# Altium project zhuzhuan1.PrjPcb
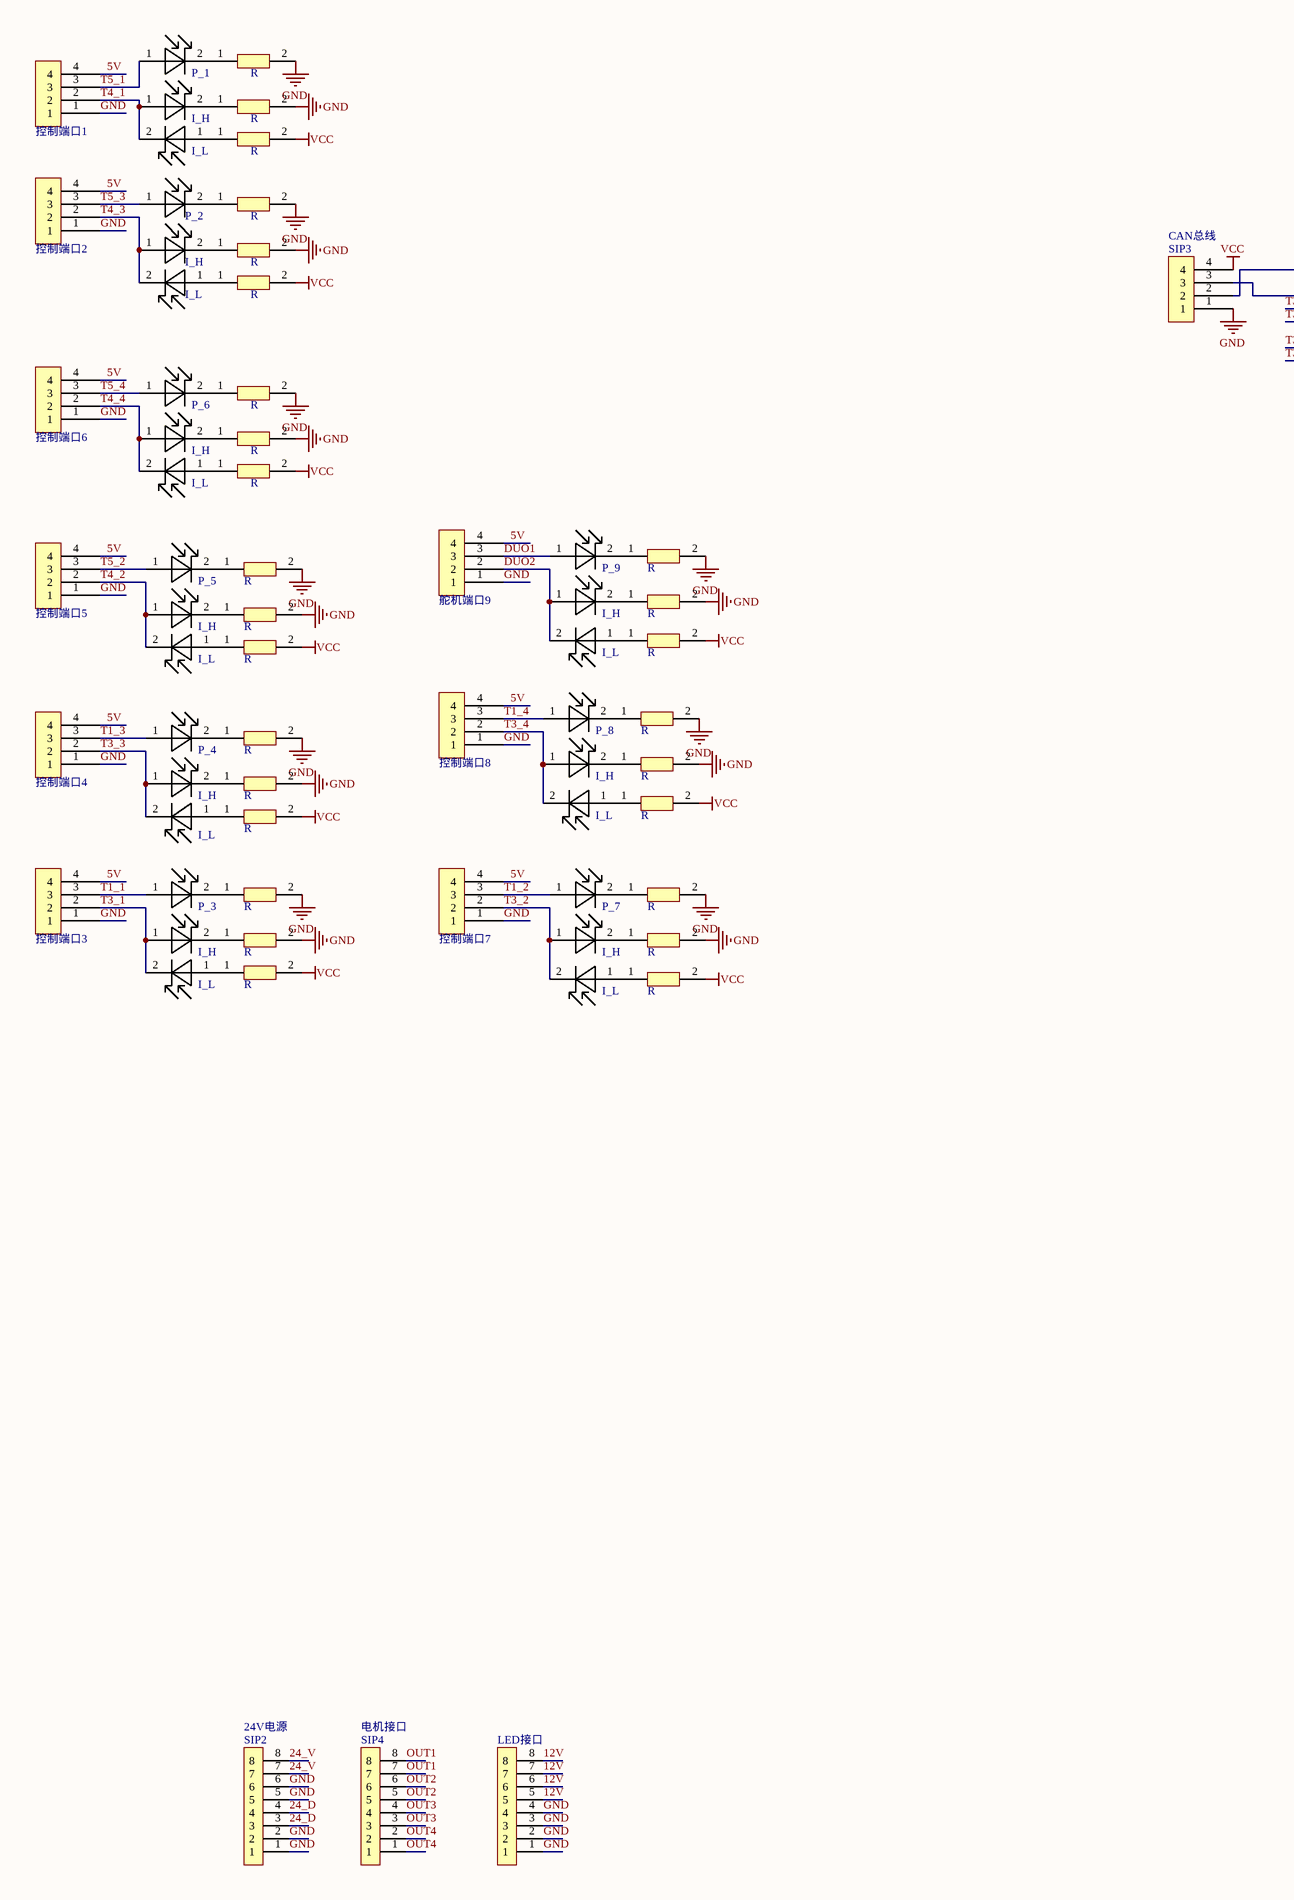
[diagram p0: zhuzhuan1.SchDoc, left]
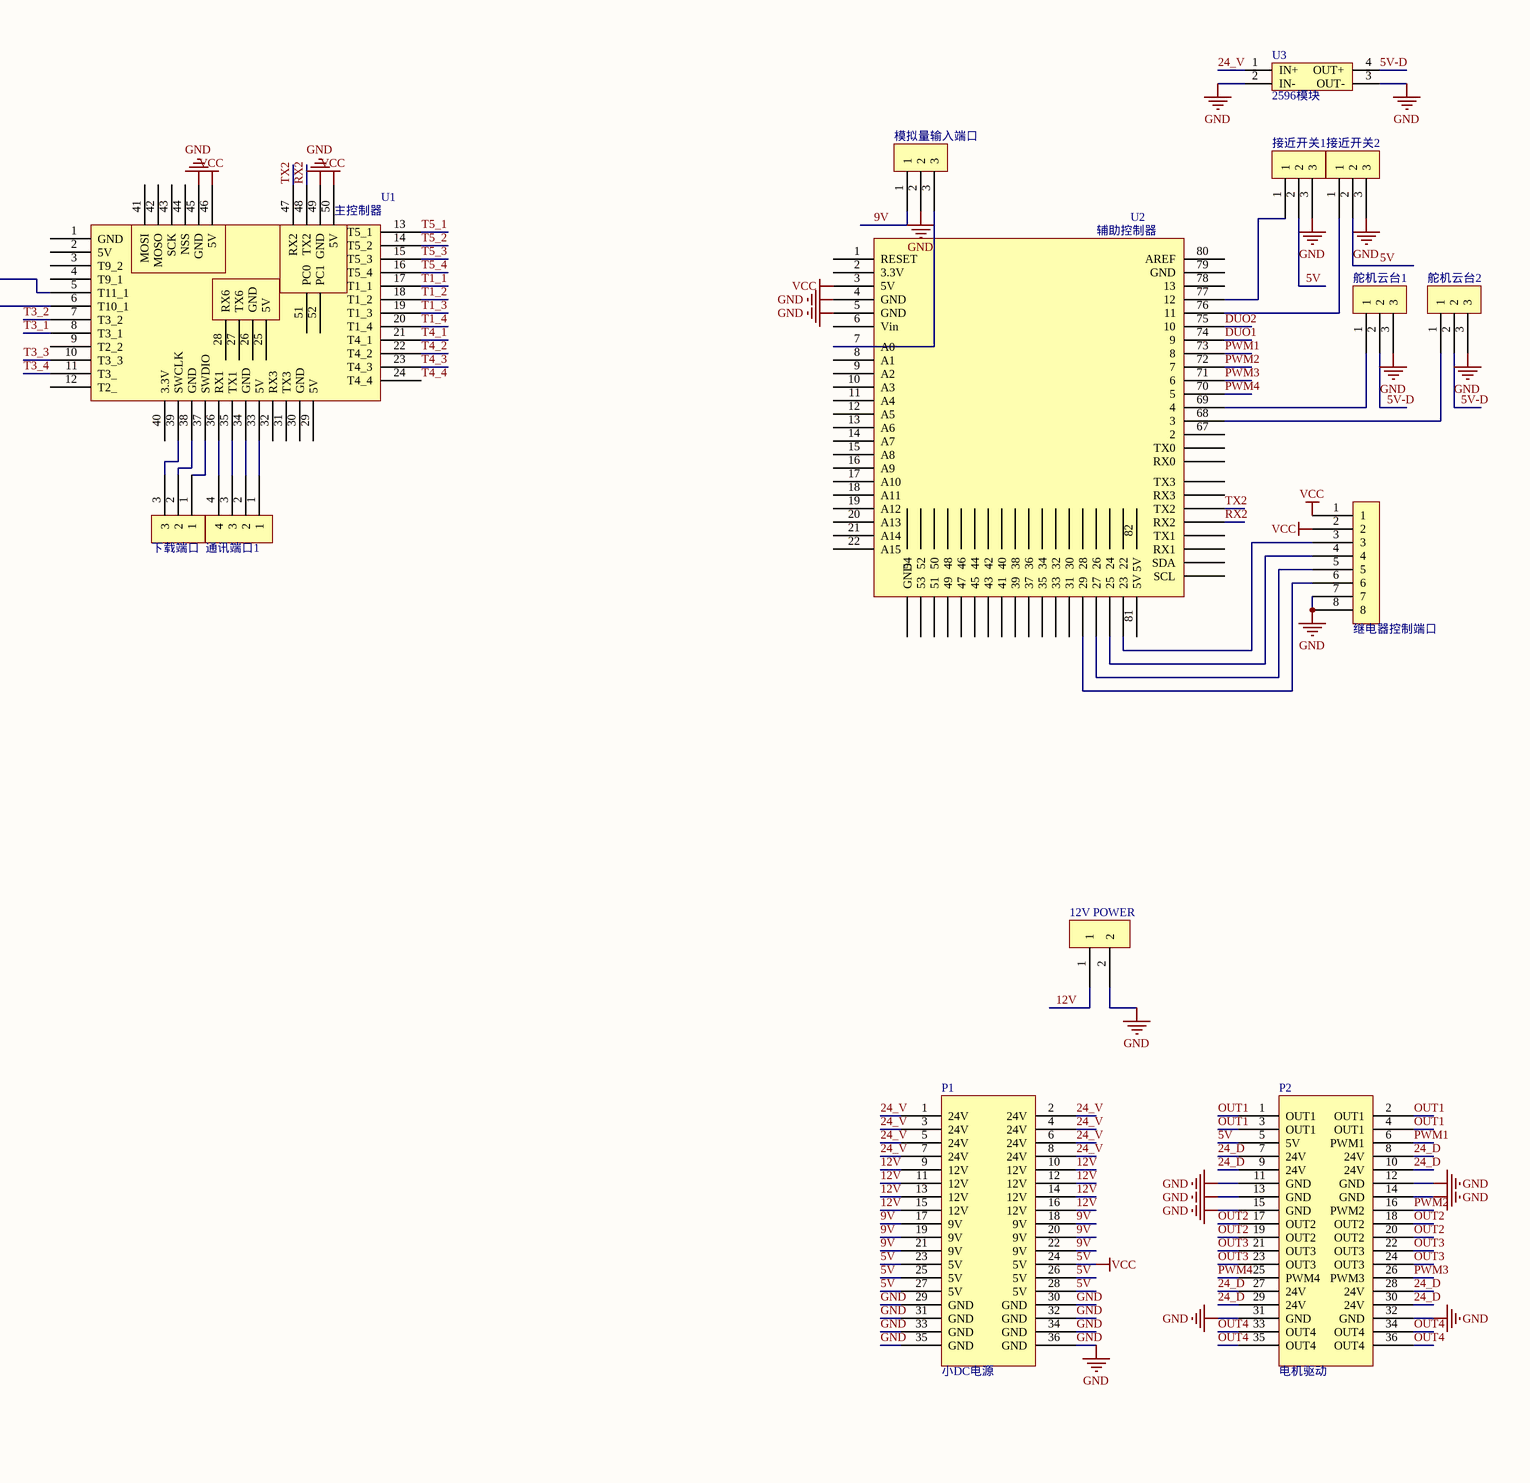
[diagram p1: zhuzhuan1.SchDoc, right]
1 sheet, 81 parts. Net scope: global (net labels, ports and power ports of the same name join across sheets).
Board file: zhuzhuan1.PcbDoc

## Sheet zhuzhuan1.SchDoc
size A2

### Parts
12V_POWER  SIP2  [SIP2-3MM]  (value not drawn)
L1  P_1  [LED-T]
L2  I_H  [LED-T]
L3  I_L  [LED-T]
L4  P_2  [LED-T]
L5  I_H  [LED-T]
L6  I_L  [LED-T]
L7  P_3  [LED-T]
L8  I_H  [LED-T]
L9  I_L  [LED-T]
L10  P_4  [LED-T]
L11  I_H  [LED-T]
L12  I_L  [LED-T]
L13  P_5  [LED-T]
L14  I_H  [LED-T]
L15  I_L  [LED-T]
L16  P_6  [LED-T]
L17  I_H  [LED-T]
L18  I_L  [LED-T]
L19  P_7  [LED-T]
L20  I_H  [LED-T]
L21  I_L  [LED-T]
L22  P_8  [LED-T]
L23  I_H  [LED-T]
L24  I_L  [LED-T]
L25  P_9  [LED-T]
L26  I_H  [LED-T]
L27  I_L  [LED-T]
P1  小DC电源  [DIP36-3.96MM]
P2  电机驱动  [DIP36-3.96MM]
R1  R  [RES-T]
R2  R  [RES-T]
R3  R  [RES-T]
R4  R  [RES-T]
R5  R  [RES-T]
R6  R  [RES-T]
R7  R  [RES-T]
R8  R  [RES-T]
R9  R  [RES-T]
R10  R  [RES-T]
R11  R  [RES-T]
R12  R  [RES-T]
R13  R  [RES-T]
R14  R  [RES-T]
R15  R  [RES-T]
R16  R  [RES-T]
R17  R  [RES-T]
R18  R  [RES-T]
R19  R  [RES-T]
R20  R  [RES-T]
R21  R  [RES-T]
R22  R  [RES-T]
R23  R  [RES-T]
R24  R  [RES-T]
R25  R  [RES-T]
R26  R  [RES-T]
R27  R  [RES-T]
SIP2  24V电源  [SIP8*3MM]
SIP3  CAN总线  [SIP4]
SIP4  电机接口  [SIP8*3MM]
SIP5  下载端口  [SIP3]
SIP7  控制端口1  [SIP4]
SIP8  控制端口2  [SIP4]
SIP9  控制端口3  [SIP4]
SIP10  控制端口4  [SIP4]
SIP11  控制端口5  [SIP4]
SIP12  控制端口6  [SIP4]
SIP13  控制端口7  [SIP4]
SIP14  控制端口8  [SIP4]
SIP15  舵机云台1  [SIP3-3MM]
SIP16  舵机云台2  [SIP3-3MM]
SIP17  模拟量输入端口  [SIP3-3MM]
SIP18  舵机端口9  [SIP4]
SIP19  LED接口  [SIP8*3MM]
SIP20  接近开关1  [SIP3-3MM]
SIP21  接近开关2  [SIP3-3MM]
SIP22  继电器控制端口  [SIP8]
U1  主控制器  [-----STM32F407-----]
U2  辅助控制器  [ARDUINO 2560]
U3  2596模块  [2596模块]
通讯端口1  SIP4  [SIP4]  (value not drawn)

### Nets
5V: P1.23(5V) P1.24(5V) P1.25(5V) P1.26(5V) P1.27(5V) P1.28(5V) P2.5(5V) R3.2 R6.2 R9.2 R12.2 R15.2 R18.2 R21.2 R24.2 R27.2 SIP3.4 SIP7.4 SIP8.4 SIP9.4 SIP10.4 SIP11.4 SIP12.4 SIP13.4 SIP14.4 SIP18.4 SIP20.2 SIP21.2 SIP22.1 SIP22.2 U1.46(5V) U1.50(5V) U2.3(5V)  [also labelled VCC]
GND: 12V_POWER.2 P1.29(GND) P1.30(GND) P1.31(GND) P1.32(GND) P1.33(GND) P1.34(GND) P1.35(GND) P1.36(GND) P2.11(GND) P2.12(GND) P2.13(GND) P2.14(GND) P2.15(GND) P2.31(GND) P2.32(GND) R1.2 R2.2 R4.2 R5.2 R7.2 R8.2 R10.2 R11.2 R13.2 R14.2 R16.2 R17.2 R19.2 R20.2 R22.2 R23.2 R25.2 R26.2 SIP2.1 SIP2.2 SIP2.5 SIP2.6 SIP3.1 SIP7.1 SIP8.1 SIP9.1 SIP10.1 SIP11.1 SIP12.1 SIP13.1 SIP14.1 SIP15.3 SIP16.3 SIP17.2 SIP18.1 SIP19.1 SIP19.2 SIP19.3 SIP19.4 SIP20.3 SIP21.3 SIP22.7 SIP22.8 U1.45(GND) U1.49(GND) U2.4(GND) U2.5(GND) U3.2(IN-) U3.3(OUT-)
5V-D: SIP15.2 SIP16.2 U3.4(OUT+)
9V: P1.17(9V) P1.18(9V) P1.19(9V) P1.20(9V) P1.21(9V) P1.22(9V) SIP17.1
12V: 12V_POWER.1 P1.9(12V) P1.10(12V) P1.11(12V) P1.12(12V) P1.13(12V) P1.14(12V) P1.15(12V) P1.16(12V) SIP19.5 SIP19.6 SIP19.7 SIP19.8
24_D: P2.7(24V) P2.8(24V) P2.9(24V) P2.10(24V) P2.27(24V) P2.28(24V) P2.29(24V) P2.30(24V) SIP2.3 SIP2.4
24_V: P1.1(24V) P1.2(24V) P1.3(24V) P1.4(24V) P1.5(24V) P1.6(24V) P1.7(24V) P1.8(24V) SIP2.7 SIP2.8 U3.1(IN+)
DUO1: L25.1 SIP18.3 U2.74(9)
DUO2: L26.1 L27.2 SIP18.2 U2.75(10)
OUT1: P2.1(OUT1) P2.2(OUT1) P2.3(OUT1) P2.4(OUT1) SIP4.7 SIP4.8
OUT2: P2.17(OUT2) P2.18(OUT2) P2.19(OUT2) P2.20(OUT2) SIP4.5 SIP4.6
OUT3: P2.21(OUT3) P2.22(OUT3) P2.23(OUT3) P2.24(OUT3) SIP4.3 SIP4.4
OUT4: P2.33(OUT4) P2.34(OUT4) P2.35(OUT4) P2.36(OUT4) SIP4.1 SIP4.2
PWM1: P2.6(PWM1) U2.73(8)
PWM2: P2.16(PWM2) U2.72(7)
PWM3: P2.26(PWM3) U2.71(6)
PWM4: P2.25(PWM4) U2.70(5)
RX2: U1.48(TX2) U2.61(RX2)
T1_1: L7.1 SIP9.3 U1.17(T1_1)
T1_2: L19.1 SIP13.3 U1.18(T1_2)
T1_3: L10.1 SIP10.3 U1.19(T1_3)
T1_4: L22.1 SIP14.3 U1.20(T1_4)
T3_1: L8.1 L9.2 SIP9.2 U1.8(T3_1)
T3_2: L20.1 L21.2 SIP13.2 U1.7(T3_2)
T3_3: L11.1 L12.2 SIP10.2 U1.10(T3_3)
T3_4: L23.1 L24.2 SIP14.2 U1.11(T3_)
T4_1: L2.1 L3.2 SIP7.2 U1.21(T4_1)
T4_2: L14.1 L15.2 SIP11.2 U1.22(T4_2)
T4_3: L5.1 L6.2 SIP8.2 U1.23(T4_3)
T4_4: L17.1 L18.2 SIP12.2 U1.24(T4_4)
T5_1: L1.1 SIP7.3 U1.13(T5_1)
T5_2: L13.1 SIP11.3 U1.14(T5_2)
T5_3: L4.1 SIP8.3 U1.15(T5_3)
T5_4: L16.1 SIP12.3 U1.16(T5_4)
TX2: U1.47(RX2) U2.62(TX2)
NetL1_2: L1.2 R1.1
NetL2_2: L2.2 R2.1
NetL3_1: L3.1 R3.1
NetL4_2: L4.2 R4.1
NetL5_2: L5.2 R5.1
NetL6_1: L6.1 R6.1
NetL7_2: L7.2 R7.1
NetL8_2: L8.2 R8.1
NetL9_1: L9.1 R9.1
NetL10_2: L10.2 R10.1
NetL11_2: L11.2 R11.1
NetL12_1: L12.1 R12.1
NetL13_2: L13.2 R13.1
NetL14_2: L14.2 R14.1
NetL15_1: L15.1 R15.1
NetL16_2: L16.2 R16.1
NetL17_2: L17.2 R17.1
NetL18_1: L18.1 R18.1
NetL19_2: L19.2 R19.1
NetL20_2: L20.2 R20.1
NetL21_1: L21.1 R21.1
NetL22_2: L22.2 R22.1
NetL23_2: L23.2 R23.1
NetL24_1: L24.1 R24.1
NetL25_2: L25.2 R25.1
NetL26_2: L26.2 R26.1
NetL27_1: L27.1 R27.1
NetSIP3_2: SIP3.2 U1.5(T11_1)
NetSIP3_3: SIP3.3 U1.6(T10_1)
NetSIP5_1: SIP5.1 U1.37(SWDIO)
NetSIP5_2: SIP5.2 U1.38(GND)
NetSIP5_3: SIP5.3 U1.39(SWCLK)
NetSIP15_1: SIP15.1 U2.69(4)
NetSIP16_1: SIP16.1 U2.68(3)
NetSIP17_3: SIP17.3 U2.7(A0)
NetSIP20_1: SIP20.1 U2.77(12)
NetSIP21_1: SIP21.1 U2.76(11)
NetSIP22_3: SIP22.3 U2.24(23)
NetSIP22_4: SIP22.4 U2.26(25)
NetSIP22_5: SIP22.5 U2.28(27)
NetSIP22_6: SIP22.6 U2.30(29)
NetU1_33: U1.33(5V) 通讯端口1.1
NetU1_34: U1.34(GND) 通讯端口1.2
NetU1_35: U1.35(TX1) 通讯端口1.3
NetU1_36: U1.36(RX1) 通讯端口1.4

Not connected (* = marked no-connect by the designer): U1 1(GND) 2(5V) 3(T9_2) 4(T9_1) 9(T2_2) 12(T2_) 25(5V) 26(GND) 27(TX6) 28(RX6) 29(5V) 30(GND) 31(TX3) 32(RX3) 40(3.3V) 41(MOSI) 42(MOSO) 43(SCK) 44(NSS) 51(PC0) 52(PC1); U2 1(RESET) 2(3.3V) 6(Vin) 8(A1) 9(A2) 10(A3) 11(A4) 12(A5) 13(A6) 14(A7) 15(A8) 16(A9) 17(A10) 18(A11) 19(A12) 20(A13) 21(A14) 22(A15) 23(22) 25(24) 27(26) 29(28) 31(30) 32(31) 33(32) 34(33) 35(34) 36(35) 37(36) 38(37) 39(38) 40(39) 41(40) 42(41) 43(42) 44(43) 45(44) 46(45) 47(46) 48(47) 49(48) 50(49) 51(50) 52(51) 53(52) 54(53) 55(54) 56(GND) 57(SCL) 58(SDA) 59(RX1) 60(TX1) 63(RX3) 64(TX3) 65(RX0) 66(TX0) 67(2) 78(13) 79(GND) 80(AREF) 81(5V) 82(5V)

### Library data of the parts
L1-L27 = LED
P1 = POWER_18*2
P2 = Header
R1-R27 = RES-T
SIP2 SIP4 SIP19 = SIP8*3MM
SIP3 SIP7-SIP14 SIP18 = SIP4
SIP5 SIP15-SIP17 SIP20 SIP21 = SIP3
SIP22 = SIP8
U1 = ------STM32F407------
U2 = ARDUINO 2560